# EAGLE design zigduino-micro-2 (EAGLE 6.3)
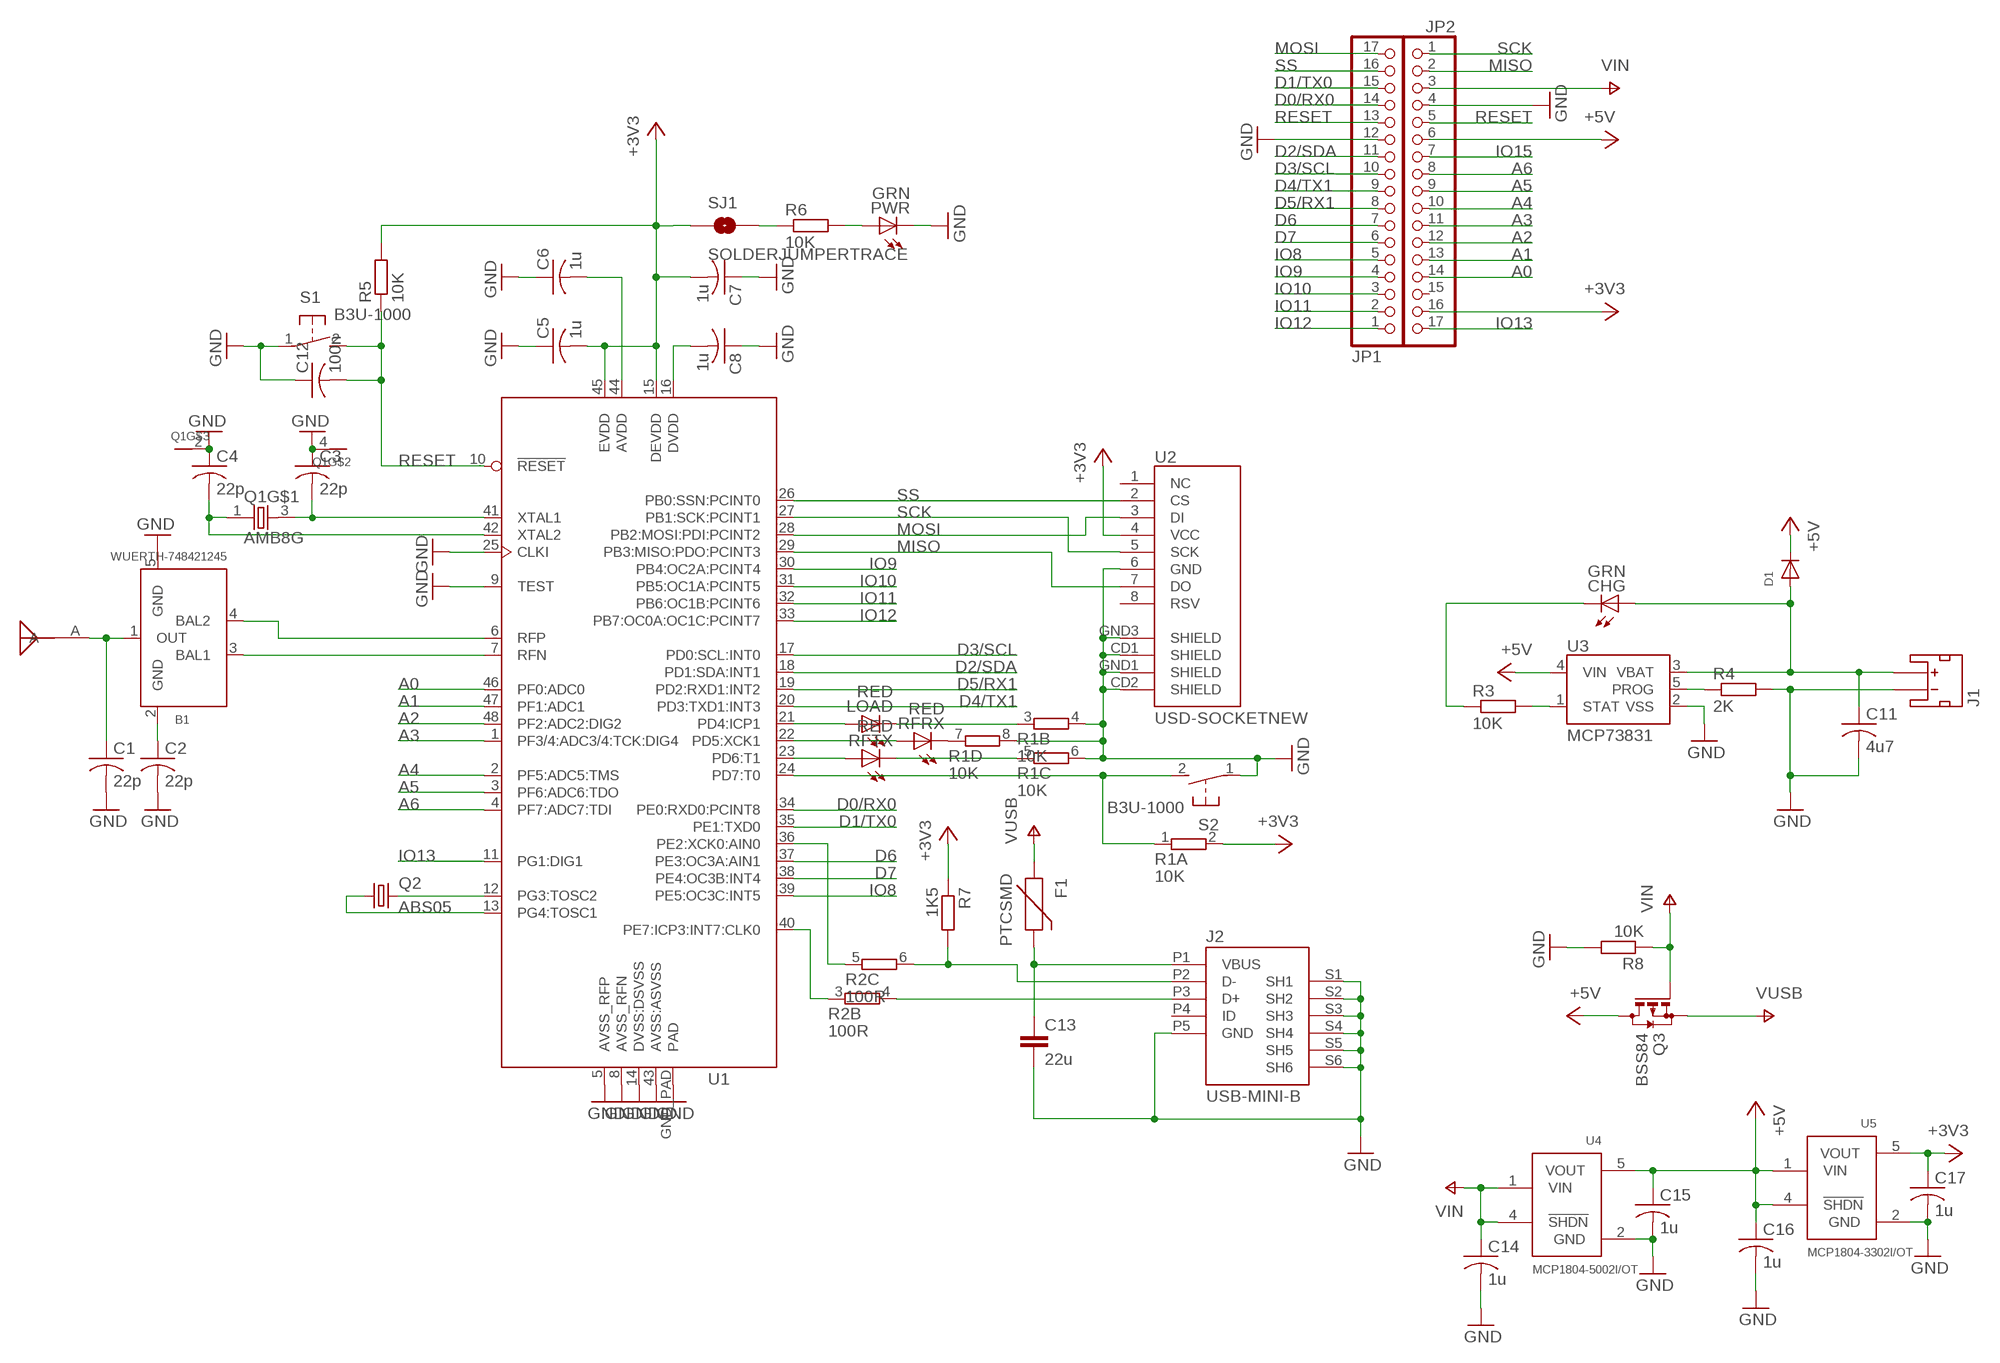
[diagram p0: schematic, sheet 1]

## Parts
ANT1  ATMEGA128RFA1_MOLEX-ANT  [ATMEGA128RFA1_MOLEX-ANT]
B1  WUERTH-748421245  [WURTH-BALUN]
C1  22p  C-USC0603  [C0603]
C2  22p  C-USC0603  [C0603]
C3  22p  C-USC0603  [C0603]
C4  22p  C-USC0603  [C0603]
C5  1u  C-USC0603  [C0603]
C6  1u  C-USC0603  [C0603]
C7  1u  C-USC0603  [C0603]
C8  1u  C-USC0603  [C0603]
C11  4u7  C-USC0603  [C0603]
C12  100n  C-USC0603  [C0603]
C13  22u  C-EUC0805  [C0805]
C14  1u  C-USC0603  [C0603]
C15  1u  C-USC0603  [C0603]
C16  1u  C-USC0603  [C0603]
C17  1u  C-USC0603  [C0603]
CHG  GRN  LEDCHIPLED_0603  [CHIPLED_0603]
D1  DIODESOD-123  [SOD-123]
F1  PTCSMD  [PTC-1206]
J1  JST_2MM_MALE  [JST-2-SMD]
J2  USB-MINI-B  [SMARTPRJ_CON2_USB_MICRO_B_AT]
JP1  PINHD-1X17_2.54-SMD  [1X17SMD]
JP2  PINHD-1X17_2.54-SMD  [1X17SMD]
LOAD  RED  LEDCHIPLED_0603  [CHIPLED_0603]
PWR  GRN  LEDCHIPLED_0603  [CHIPLED_0603]
Q1  AMB8G  [ABM8G]
Q2  ABS05  [ABS05]
Q3  BSS84  [SOT23]
R1  10K  4R-NCTS742C083  [CTS742C083-RES]
R2  100R  4R-NCTS742C083  [CTS742C083-RES]
R3  10K  R-EU_R0603  [R0603]
R4  2K  R-EU_R0603  [R0603]
R5  10K  R-EU_R0603  [R0603]
R6  10K  R-EU_R0603  [R0603]
R7  1K5  R-EU_R0603  [R0603]
R8  10K  R-EU_R0603  [R0603]
RFRX  RED  LEDCHIPLED_0603  [CHIPLED_0603]
RFTX  RED  LEDCHIPLED_0603  [CHIPLED_0603]
S1  B3U-1000  [B3U]
S2  B3U-1000  [B3U]
SJ1  SOLDERJUMPERTRACE  [SJ_2S-TRACE]
U1  ATMEGA1284RFR2  [QFN48]
U2  USD-SOCKETNEW  [MICRO-SD-SOCKET-PP]
U3  MCP73831  [SOT23-5]
U4  MCP1804-5002I/OT  [SOT23-5L]
U5  MCP1804-3302I/OT  [SOT23-5L]

## Nets
+3V3: C5.2 C7.2 C17.1 JP2.16 R1.2 R5.2 R7.1 SJ1.1 U1.15(DEVDD) U1.45(EVDD) U2.4(VCC) U5.5(VOUT)
+5V: C15.1 C16.1 D1.C JP2.6 Q3.3(D) U3.4(VIN) U4.5(VOUT) U5.1(VIN) U5.4(!SHDN!)
A0: JP2.14 U1.46(PF0:ADC0)
A1: JP2.13 U1.47(PF1:ADC1)
A2: JP2.12 U1.48(PF2:ADC2:DIG2)
A3: JP2.11 U1.1(PF3/4:ADC3/4:TCK:DIG4)
A4: JP2.10 U1.2(PF5:ADC5:TMS)
A5: JP2.9 U1.3(PF6:ADC6:TDO)
A6: JP2.8 U1.4(PF7:ADC7:TDI)
D0/RX0: JP1.14 U1.34(PE0:RXD0:PCINT8)
D1/TX0: JP1.15 U1.35(PE1:TXD0)
D2/SDA: JP1.11 U1.18(PD1:SDA:INT1)
D3/SCL: JP1.10 U1.17(PD0:SCL:INT0)
D4/TX1: JP1.9 U1.20(PD3:TXD1:INT3)
D5/RX1: JP1.8 U1.19(PD2:RXD1:INT2)
D6: JP1.7 U1.37(PE3:OC3A:AIN1)
D7: JP1.6 U1.38(PE4:OC3B:INT4)
GND: B1.5(GND) C1.2 C2.2 C3.1 C4.1 C5.1 C6.1 C7.1 C8.1 C11.2 C12.1 C13.2 C14.2 C15.2 C16.2 C17.2 J1.1(-) J2.P5(GND) J2.S1(SH1) J2.S2(SH2) J2.S3(SH3) J2.S4(SH4) J2.S5(SH5) J2.S6(SH6) JP1.12 JP2.4 PWR.C Q1.2(PIN) Q1.4(PIN) R1.4 R1.6 R1.8 R4.2 R8.2 S1.1 S2.1 U1.5(AVSS_RFP) U1.8(AVSS_RFN) U1.9(TEST) U1.14(DVSS:DSVSS) U1.25(CLKI) U1.43(AVSS:ASVSS) U1.GND_PAD(PAD) U2.6(GND) U2.CD1(SHIELD) U2.CD2(SHIELD) U2.GND1(SHIELD) U2.GND3(SHIELD) U3.2(VSS) U4.2(GND) U5.2(GND)
IO8: JP1.5 U1.39(PE5:OC3C:INT5)
IO9: JP1.4 U1.30(PB4:OC2A:PCINT4)
IO10: JP1.3 U1.31(PB5:OC1A:PCINT5)
IO11: JP1.2 U1.32(PB6:OC1B:PCINT6)
IO12: JP1.1 U1.33(PB7:OC0A:OC1C:PCINT7)
IO13: JP2.17 U1.11(PG1:DIG1)
IO15: JP2.7
MISO: JP2.2 U1.29(PB3:MISO:PDO:PCINT3) U2.7(DO)
MOSI: JP1.17 U1.28(PB2:MOSI:PDI:PCINT2) U2.3(DI)
N$1: ANT1.A B1.1(OUT) C1.1
N$2: B1.3(BAL1) U1.7(RFN)
N$3: B1.4(BAL2) U1.6(RFP)
N$4: B1.2(GND) C2.1
N$5: C3.2 Q1.3 U1.41(XTAL1)
N$6: Q2.2 U1.12(PG3:TOSC2)
N$7: C4.2 Q1.1 U1.42(XTAL2)
N$8: C6.2 U1.44(AVDD)
N$9: Q2.1 U1.13(PG4:TOSC1)
N$10: C8.2 U1.16(DVDD)
N$11: LOAD.A U1.21(PD4:ICP1)
N$12: R2.3 U1.40(PE7:ICP3:INT7:CLK0)
N$13: R2.5 U1.36(PE2:XCK0:AIN0)
N$14: RFTX.A U1.23(PD6:T1)
N$15: PWR.A R6.2
N$16: RFRX.A U1.22(PD5:XCK1)
N$17: R1.7 RFRX.C
N$18: R1.5 RFTX.C
N$19: J2.P2(D-) R2.6 R7.2
N$20: J2.P3(D+) R2.4
N$21: LOAD.C R1.3
N$22: R1.1 S2.2 U1.24(PD7:T0)
N$23: R6.1 SJ1.2
N$25: C11.1 CHG.A D1.A J1.2(+) U3.3(VBAT)
N$26: R3.2 U3.1(STAT)
N$27: R4.1 U3.5(PROG)
N$28: C13.1 F1.2 J2.P1(VBUS)
N$29: CHG.C R3.1
RESET: C12.2 JP1.13 JP2.5 R5.1 S1.2 U1.10(!RESET!)
SCK: JP2.1 U1.27(PB1:SCK:PCINT1) U2.5(SCK)
SS: JP1.16 U1.26(PB0:SSN:PCINT0) U2.2(CS)
VIN: C14.1 JP2.3 Q3.1(G) R8.1 U4.1(VIN) U4.4(!SHDN!)
VUSB: F1.1 Q3.2(S)
Unconnected: J1.NC1(PAD1) J1.NC2(PAD2) J2.P4(ID) JP2.15 R2.1 R2.2 R2.7 R2.8 U2.1(NC) U2.8(RSV)

## Library data of the parts
ANT1 = atmega128rfa1:ATMEGA128RFA1_MOLEX-ANT
B1 = atmega128rfa1:WUERTH-748421245: Recommended Balun for Atmega128RFA1
C1-C8 C11 C12 C14-C17 = resistor:C-US: CAPACITOR, American symbol
C13 = resistor:C-EU: CAPACITOR, European symbol
CHG LOAD PWR RFRX RFTX = led:LED: LED OSRAM: - CHIPLED LG R971, LG N971, LY N971, LG Q971, LY Q971, LO R971, LY R971 LH N974, LH R974 LS Q976, LO Q976, LY Q976 LO Q996 - Hyper CHIPLED LW Q18S LB Q993, LB Q99A, LB R99A - SideLED LS A670, LO A670, LY A670, LG A670, LP A670 LB A673, LV A673, LT A673, LW A673 LH A674 LY A675 LS A676, LA A676, LO A676, LY A676, LW A676 LS A679, LY A679, LG A679 - Hyper Micro SIDELED® LS Y876, LA Y876, LO Y876, LY Y876 LT Y87S - SmartLED LW L88C, LW L88S LB L89C, LB L89S, LG L890 LS L89K, LO L89K, LY L89K LS L896, LA L896, LO L896, LY L896 - TOPLED LS T670, LO T670, LY T670, LG T670, LP T670 LSG T670, LSP T670, LSY T670, LOP T670, LYG T670 LG T671, LOG T671, LSG T671 LB T673, LV T673, LT T673, LW T673 LH T674 LS T676, LA T676, LO T676, LY T676, LB T676, LH T676, LSB T676, LW T676 LB T67C, LV T67C, LT T67C, LS T67K, LO T67K, LY T67K, LW E67C LS E67B, LA E67B, LO E67B, LY E67B, LB E67C, LV E67C, LT E67C LW T67C LS T679, LY T679, LG T679 LS T770, LO T770, LY T770, LG T770, LP T770 LB T773, LV T773, LT T773, LW T773 LH T774 LS E675, LA E675, LY E675, LS T675 LS T776, LA T776, LO T776, LY T776, LB T776 LHGB T686 LT T68C, LB T68C - Hyper Mini TOPLED® LB M676 - Mini TOPLED Santana® LG M470 LS M47K, LO M47K, LY M47K Source: http://www.osram.convergy.de/
D1 = adafruit:DIODE: Diode SMADIODE - SMA Surface Mount Package 20V 1A Schottky Diode Digikey: 641-1014-6-ND DO-1N4148 - Through Hole Small Current Diode SOD-123 20V 1 A (.5mV Vf) Schottky Diode - Digikey: MBRX120TPMSCT-ND SOD-323 10V 570mA (.38mV Vf, 3ns) Schottky Diode - Digikey: ZLLS410CT-ND SOD-523 30V 30mA Schottky Diode (RB751S-40TE61) - Digikey: RB751S-40TE61CT-ND SOT23-R/W - SOT23 Package (R = Solder Paste/Reflow Ovens, W = Hand-Soldering) BAT54Film 40V 300mA - Digikey: 497-7162-1-ND
F1 = SparkFun-PowerIC:PTC: Resettable Fuse PTC Resettable Fuse. Spark Fun Electronics SKU : COM-08357
J1 = SparkFun-Connectors:JST_2MM_MALE: Mates to single-cell LiPo batteries. CONN-08352; PROD_ID: CONN-08352
J2 = logos-ftdi:USB-MINI-B
JP1 JP2 = pinhead-1:PINHD-1X17: PIN HEADER
Q1 = atmega128rfa1:AMB8G: AMB8G series ultraminature crystal
Q2 = logos-crystals:ABS05
Q3 = transistor-small-signal:BSS84: P-CHANNEL MOS FET
R1 R2 = res-cap-arrays:4R-N: Array Chip Resistor Source: RS Component / Phycomp
R3-R8 = resistor:R-EU_: RESISTOR, European symbol
S1 S2 = logos-faves:B3U-1000: Omron B3U-1000 SMD tact switch
SJ1 = SparkFun-Passives:SOLDERJUMPER: Solder Jumper Standard SMD solder jumper. Used to automate production. Two varients : Normally Open and Normally Closed are the same, but have different paste layers. NC will have a large amount of paste and should jumper during reflow.
U1 = atmega128rfa1:ATMEGA1284RFR2
U2 = SparkFun-Connectors:USD-SOCKET: microSD Socket Push-push type uSD socket. Schematic element and footprint production proven. Spark Fun Electronics SKU : PRT-00127. tDoc lines correctly indicate media card edge positions when inserting (unlocked, locked, depressed).
U3 = SparkFun-PowerIC:MCP73831: Miniature single cell, fully integrated Li-Ion, Li-polymer charge management controller http://ww1.microchip.com/downloads/en/DeviceDoc/21984a.pdf IC-09995; PROD_ID: IC-09995
U4 U5 = logos-power:MCP1804

## Board
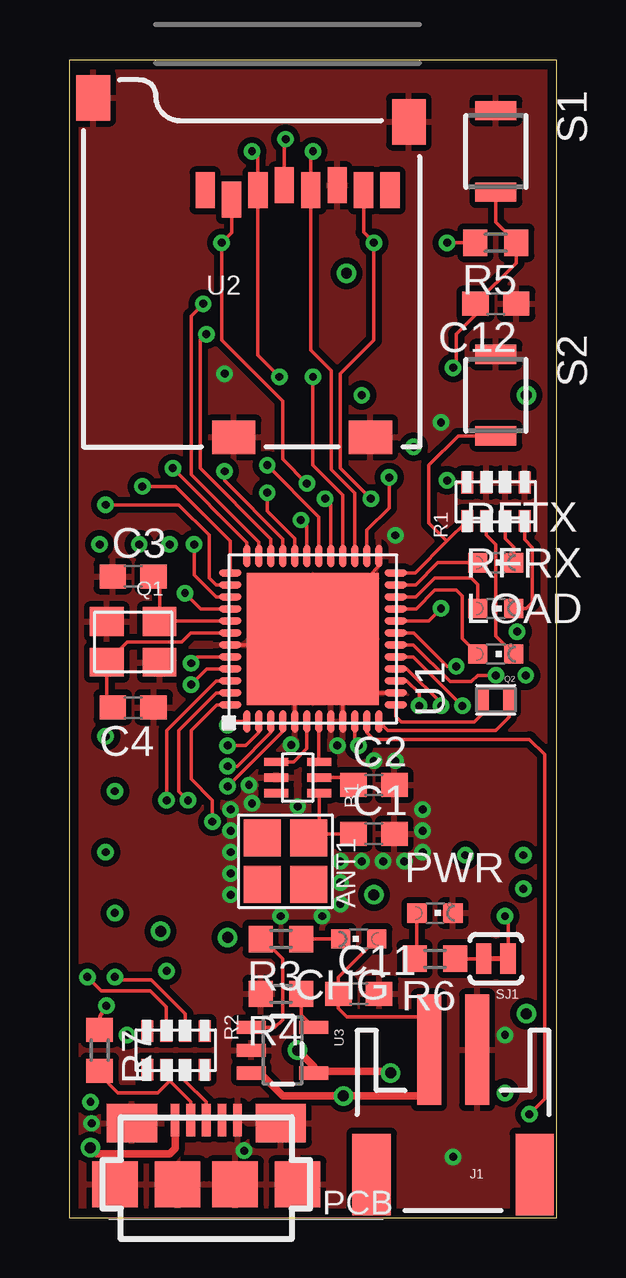
[diagram p1: board, top side]
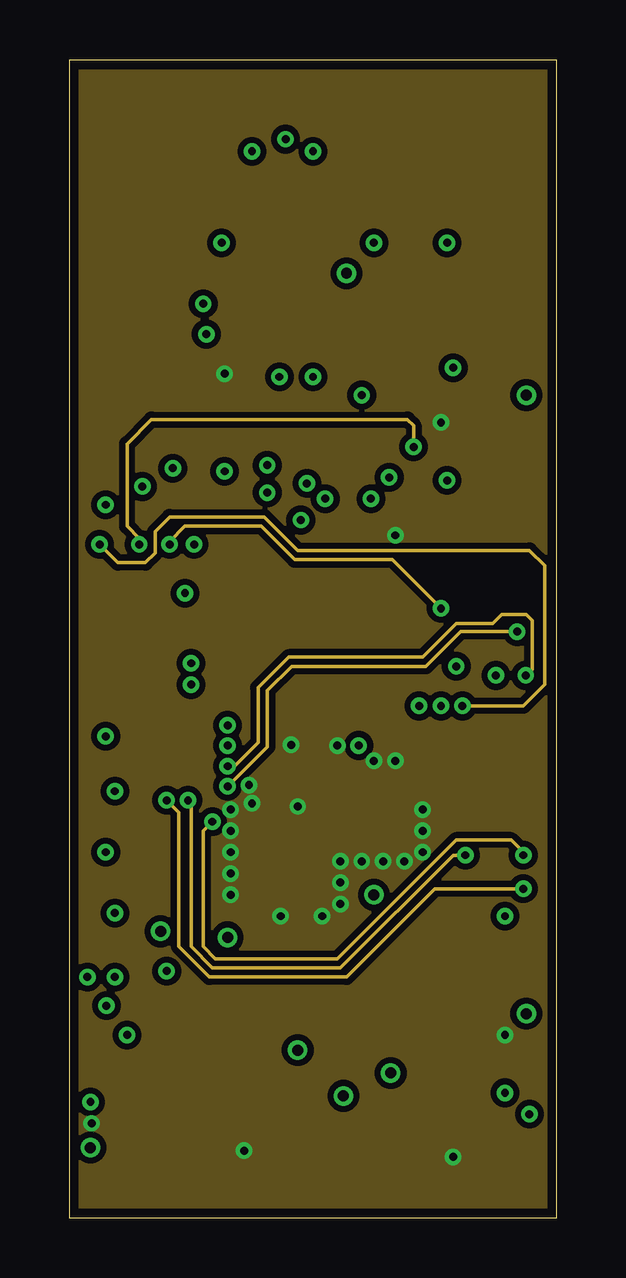
[diagram p2: board, inner layer Route2]
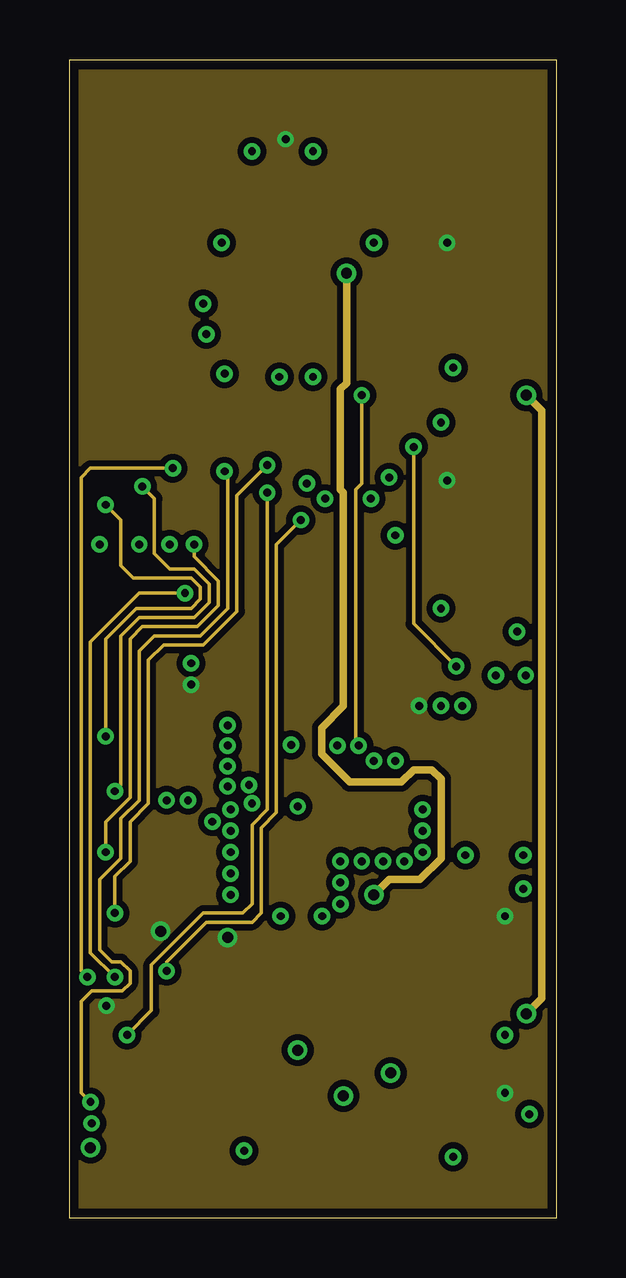
[diagram p3: board, inner layer Route15]
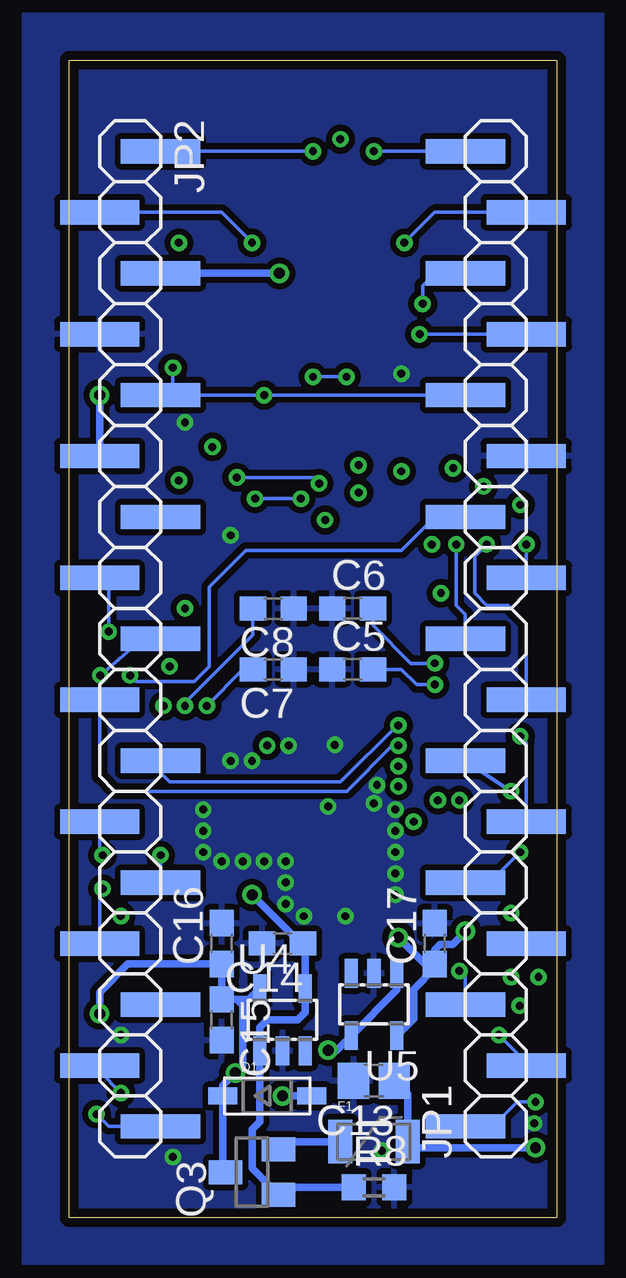
[diagram p4: board, bottom side, seen from below]

Size 20.32 x 48.26 mm. Coordinates in mm from the lower left corner, seen from the top.
Outline: 0,0 20.32,0 20.32,48.26 0,48.26 0,0
Copper layers (1*2+15*16): Top 0.0356mm / dielectric 1.5011mm / Route2 0.0356mm / dielectric 0.1499mm / Route15 0.0356mm / dielectric 0.2007mm / Bottom 0.0356mm
Design rules "LaenPCBOrder *": minimum track width 6mil, minimum drill 13mil, track to track 6mil, track to pad 6mil, pad to pad 6mil, via to via 6mil, smd to smd 6mil, copper to edge 15mil, drill to drill 6mil, minimum pad ring 7mil, minimum via ring 7mil, stop-mask expansion 4mil, vias tented up to drill 0mil, thermal gap 10mil

### Footprints (pad centres in the part's own frame; a part is rotated, then mirrored left to right if it is on the bottom)
ATMEGA128RFA1_MOLEX-ANT = smd 1.54 x 1.54: A -0.97,0.97; D@0 0.97,0.97; D@1 0.97,-0.97; D@2 -0.97,-0.97
WURTH-BALUN = smd 0.35 x 1: 1 0.65,0.9; 2 0,0.9; 3 -0.65,0.9; 4 -0.65,-0.9; 5 0,-0.9; 6 0.65,-0.9
C0603 = smd 1.1 x 1: 1 -0.85,0; 2 0.85,0
C0805 = smd 1.3 x 1.5: 1 -0.85,0; 2 0.85,0
CHIPLED_0603 = smd 0.8 x 0.8: A 0,-0.75; C 0,0.75
SOD-123 = smd 1.2 x 0.7: A 1.85,0; C -1.85,0
PTC-1206 = smd 1 x 1.8: 1 -1.4,0; 2 1.4,0
JST-2-SMD = smd 1 x 4.6: 1 -1,-3.7; 2 1,-3.7 | smd 1.6 x 3.4: NC1 -3.4,1.5; NC2 3.4,1.5
SMARTPRJ_CON2_USB_MICRO_B_AT = smd 0.4 x 1.35: P1 -1.3,2.675; P2 -0.65,2.675; P3 0,2.675; P4 0.65,2.675; P5 1.3,2.675 | smd 1.9 x 1.9: S1 -3.8,0; S2 3.8,0; S5 -1.2,0; S6 1.2,0 | smd 2.1 x 1.6: S3 -3.1,2.55; S4 3.1,2.55
1X17SMD = smd 1.016 x 3.302: 1 -1.27,1.27; 2 1.27,-1.27; 3 3.81,1.27; 4 6.35,-1.27; 5 8.89,1.27; 6 11.43,-1.27; 7 13.97,1.27; 8 16.51,-1.27; 9 19.05,1.27; 10 21.59,-1.27; 11 24.13,1.27; 12 26.67,-1.27; 13 29.21,1.27; 14 31.75,-1.27; 15 34.29,1.27; 16 36.83,-1.27; 17 39.37,1.27
ABM8G = smd 1.4 x 1.2: 1 -1.1,-0.85; 2 1.1,-0.85; 3 1.1,0.85; 4 -1.1,0.85
ABS05 = smd 0.5 x 1: 1 -0.55,0; 2 0.55,0
SOT23 = smd 1 x 1.4: 1 -0.95,-1.1; 2 0.95,-1.1; 3 0,1.1
CTS742C083-RES = smd 0.9 x 0.5: 1 -0.8,1.2; 2 0.8,1.2; 3 -0.8,0.4; 4 0.8,0.4; 5 -0.8,-0.4; 6 0.8,-0.4; 7 -0.8,-1.2; 8 0.8,-1.2
R0603 = smd 1 x 1.1: 1 -0.85,0; 2 0.85,0
B3U = smd 0.8 x 1.7: 1 -1.7,0; 2 1.7,0
SJ_2S-TRACE = smd 0.635 x 1.27: 1 -0.508,0; 2 0.508,0
QFN48 = smd 0.95 x 0.3: 1 -3.45,2.75; 2 -3.45,2.25; 3 -3.45,1.75; 4 -3.45,1.25; 5 -3.45,0.75; 6 -3.45,0.25; 7 -3.45,-0.25; 8 -3.45,-0.75; 9 -3.45,-1.25; 10 -3.45,-1.75; 11 -3.45,-2.25; 12 -3.45,-2.75; 25 3.45,-2.75; 26 3.45,-2.25; 27 3.45,-1.75; 28 3.45,-1.25; 29 3.45,-0.75; 30 3.45,-0.25; 31 3.45,0.25; 32 3.45,0.75; 33 3.45,1.25; 34 3.45,1.75; 35 3.45,2.25; 36 3.45,2.75 | smd 0.3 x 0.95: 13 -2.75,-3.45; 14 -2.25,-3.45; 15 -1.75,-3.45; 16 -1.25,-3.45; 17 -0.75,-3.45; 18 -0.25,-3.45; 19 0.25,-3.45; 20 0.75,-3.45; 21 1.25,-3.45; 22 1.75,-3.45; 23 2.25,-3.45; 24 2.75,-3.45; 37 2.75,3.45; 38 2.25,3.45; 39 1.75,3.45; 40 1.25,3.45; 41 0.75,3.45; 42 0.25,3.45; 43 -0.25,3.45; 44 -0.75,3.45; 45 -1.25,3.45; 46 -1.75,3.45; 47 -2.25,3.45; 48 -2.75,3.45 | smd 5.5 x 5.5: GND_PAD 0,0
MICRO-SD-SOCKET-PP = smd 0.8 x 1.5: 1 -8.94,10.7; 2 -7.84,10.3; 3 -6.74,10.7; 4 -5.64,10.9; 5 -4.54,10.7; 6 -3.44,10.9; 7 -2.34,10.7; 8 -1.24,10.7 | smd 1.8 x 1.4: CD1 -2.05,0.4; CD2 -7.75,0.4 | smd 1.4 x 1.9: GND1 -13.6,14.55; GND3 -0.45,13.55
SOT23-5 = smd 0.55 x 1.2: 1 -0.95,-1.3; 2 0,-1.3; 3 0.95,-1.3; 4 0.95,1.3; 5 -0.95,1.3
SOT23-5L = smd 0.55 x 1.2: 1 -0.95,-1.3; 2 0,-1.3; 3 0.95,-1.3; 4 0.95,1.3; 5 -0.95,1.3

### Placement (x,y rotation side)
ANT1  9.02,14.86 270 top
B1  9.53,18.35 270 top
C1  12.7,16 0 top
C2  12.7,18.03 0 top
C3  2.67,26.73 0 top
C4  2.67,21.27 180 top
C5  8.51,22.86 0 bottom
C6  8.51,25.4 0 bottom
C7  11.81,22.86 180 bottom
C8  11.81,25.4 180 bottom
C11  12.06,9.33 0 top
C12  17.78,38.1 180 top
C13  7.62,5.71 180 bottom
C14  11.43,11.43 180 bottom
C15  13.97,8.26 270 bottom
C16  13.97,11.43 90 bottom
C17  5.08,11.43 90 bottom
CHG  12.06,11.62 90 top
D1  12.06,5.08 0 bottom
F1  7.62,3.17 0 bottom
J1  16,3.3 180 top
J2  5.71,1.4 0 top
JP1  2.54,5.08 90 bottom
JP2  17.78,43.18 270 bottom
LOAD  17.78,23.5 270 top
PWR  15.24,12.7 270 top
Q1  2.67,24 0 top
Q2  17.78,21.59 0 top
Q3  12.7,1.91 90 bottom
R1  17.78,29.84 90 top
R2  4.45,6.99 270 top
R3  8.83,11.62 180 top
R4  8.83,9.33 180 top
R5  17.78,40.64 180 top
R6  15.24,10.79 180 top
R7  1.27,6.99 270 top
R8  7.62,1.27 0 bottom
RFRX  17.78,25.4 270 top
RFTX  17.78,27.3 270 top
S1  17.78,44.45 270 top
S2  17.78,34.29 270 top
SJ1  17.78,10.79 180 top
U1  10.16,24.13 90 top
U2  14.61,32.13 0 top
U3  8.89,6.99 270 top
U4  11.43,8.26 0 bottom
U5  7.62,8.89 180 bottom

### Tracks (layer width: path | path; a pad name or v marks a point on that pad's centre or on a via)
+3V3  (via drill 0.33, 0.46)
  Top 0.152: U2.4 8.96,44.91 v9.02,44.96 | R5.2 v15.75,40.64 | R1.2 15.84,30.64 v15.75,30.73 | U1.15 14.07,22.38 14.58,21.87 v14.58,21.34 | U1.45 5.74,22.88 v5.08,22.23 | R7.1 1.27,8.38 v1.55,8.84 | SJ1.1 18.29,12.45 v18.16,12.57
  Route15 0.305: v3.81,11.94 3.81,12.19
  Bottom 0.152: C7.2 13.08,22.86 v14.58,21.34 | JP2.16 19.05,6.1 v18.16,5.21 | C5.2 6.48,22.86 5.84,22.23 v5.08,22.23
  Bottom 0.305: 5.08,10.41 C17.1 5.08,11.18 4.85,11.4 4.34,11.4 v3.81,11.94 | 5.08,10.41 5.97,9.53 5.97,8.29 U5.5 | 5.08,10.41 5.33,10.41 v6.6,11.68
  pour Route15 (isolate 0.254): -1.27,49.53 21.59,49.53 21.59,-1.27 -1.27,-1.27
+5V  (via drill 0.46)
  Top 0.305: U3.4 10.19,6.19 | v9.53,6.99 10.19,6.32 10.19,6.19 | 10.19,6.19 10.29,6.1 13.34,6.1 v13.4,6.03
  Route15 0.305: v19.05,8.51 19.68,9.14 19.68,33.66 v19.05,34.29
  Bottom 0.305: 13.34,9.11 C15.1 C16.1 17.87,10.58 19.05,9.4 v19.05,8.51 | 13.34,9.11 12.83,9.11 U4.5 | Q3.3 13.91,2.02 D1.C 13.91,5.52 v13.4,6.03 13.08,6.35 13.08,8.85 13.34,9.11 | U5.1 6.67,9.49 U5.4 9.18,6.99 v9.53,6.99 | v19.05,34.29 JP2.6
A0  (via drill 0.33)
  Top 0.152: U1.46 6.12,22.38 4.06,20.32 v4.06,17.4
  Route2 0.152: v18.92,13.72 15.24,13.72 11.56,10.03 5.84,10.03 4.57,11.3 4.57,16.89 v4.06,17.4
  Bottom 0.152: JP2.14 19.05,13.59 v18.92,13.72
A1  (via drill 0.33)
  Top 0.152: U1.47 6.13,21.88 4.57,20.32 4.57,17.78 v4.95,17.4
  Route2 0.152: v16.51,15.11 16,15.11 11.3,10.41 5.97,10.41 5.08,11.3 5.08,17.27 v4.95,17.4
  Bottom 0.152: JP2.13 v16.51,15.11
A2  (via drill 0.33)
  Top 0.152: U1.48 6.14,21.38 5.08,20.32 5.08,18.29 5.97,17.4 v5.97,16.51
  Route2 0.152: v18.92,15.11 18.92,15.24 18.41,15.75 16.13,15.75 11.18,10.79 6.1,10.79 5.59,11.3 5.59,16.13 v5.97,16.51
  Bottom 0.152: JP2.12 19.05,15.24 v18.92,15.11
A3  (via drill 0.33)
  Top 0.152: U1.1 6.71,20.68 v6.6,20.52
  Bottom 0.152: JP2.11 16.51,18.54 16.13,18.16 9.02,18.16 6.66,20.52 v6.6,20.52
A4  (via drill 0.33)
  Top 0.152: U1.2 7.91,20.23 7.37,19.68 v6.6,19.68
  Bottom 0.152: 17.65,21.59 JP2.10 19.05,18.41 18.41,17.78 8.76,17.78 6.86,19.68 v6.6,19.68
A5  (via drill 0.33)
  Top 0.152: U1.3 8.41,20.22 7.01,18.82 v6.6,18.82
  Route2 0.152: v19.02,22.61 19.05,22.61 19.3,22.86 19.3,24.89 19.05,25.15 18.03,25.15 17.65,24.77 16.13,24.77 14.73,23.37 9.14,23.37 7.87,22.1 7.87,19.81 6.88,18.82 v6.6,18.82
  Bottom 0.152: JP2.9 17.27,24.13 v19.02,22.61
A6  (via drill 0.33)
  Top 0.152: U1.4 8.91,20.26 7.9,19.28 v6.6,17.98
  Route2 0.152: v18.67,24.43 16.31,24.43 14.86,22.99 9.27,22.99 8.26,21.97 8.26,19.63 v6.6,17.98
  Bottom 0.152: 18.92,26.67 JP2.8 18.67,26.29 v18.67,24.43
D0/RX0  (via drill 0.33)
  Top 0.152: U1.34 8.41,28.29 5.46,31.24 5.46,36.58 v5.71,36.83
  Bottom 0.152: v5.71,36.83 JP1.14
D1/TX0  (via drill 0.33)
  Top 0.152: U1.35 7.91,28.16 5.08,30.99 5.08,37.59 v5.59,38.1
  Bottom 0.152: v5.59,38.1 5.59,38.86 5.08,39.37 JP1.15
D2/SDA  (via drill 0.33)
  Top 0.152: U1.18 14.35,23.88 15.88,22.35 16.76,22.35 17.02,22.61 v17.78,22.61
  Bottom 0.152: JP1.11 5.08,29.21 6.48,27.81 12.95,27.81 14.48,26.29 14.48,22.99 15.11,22.35 17.53,22.35 v17.78,22.61
D3/SCL  (via drill 0.33)
  Top 0.152: U1.17 14.34,23.38 v16.38,21.34
  Route2 0.152: v16.38,21.34 18.92,21.34 19.81,22.23 19.81,27.18 19.18,27.81 9.53,27.81 8.13,29.21 4.19,29.21 3.58,28.6 3.58,27.71 3.17,27.3 2.03,27.3 v1.27,28.07
  Bottom 0.152: JP1.10 v1.27,28.07
D4/TX1  (via drill 0.33)
  Top 0.152: U1.20 14.97,24.88 v15.49,25.4
  Route2 0.152: v4.19,28.07 4.19,28.19 4.83,28.83 8,28.83 9.4,27.43 13.46,27.43 v15.49,25.4
  Bottom 0.152: JP1.9 3.81,25.15 4.19,25.53 v4.19,28.07
D5/RX1  (via drill 0.33)
  Top 0.152: U1.19 14.36,24.38 15.75,22.99 v16.13,22.99
  Route2 0.152: v2.92,28.07 2.92,28.32 2.41,28.83 2.41,32.26 3.43,33.27 14.1,33.27 14.35,33.02 v14.35,32.13
  Route15 0.152: v14.35,32.13 14.35,24.77 v16.13,22.99
  Bottom 0.152: JP1.8 1.27,24.77 2.03,25.53 2.92,25.53 3.43,26.04 3.43,27.56 v2.92,28.07
D6  (via drill 0.33)
  Top 0.152: U1.37 6.71,28.21 4.45,30.48 v3.05,30.48
  Route15 0.152: v3.05,30.48 3.56,29.97 3.56,27.69 4.19,27.05 5.21,27.05 5.84,26.42 5.84,25.65 5.21,25.02 2.92,25.02 2.16,24.26 2.16,18.03 v1.91,17.78
  Bottom 0.152: JP1.7 v1.91,17.78
D7  (via drill 0.33)
  Top 0.152: U1.38 6.13,26.38 5.84,26.67 5.84,28.45 4.57,29.72 v1.52,29.72
  Route15 0.152: v1.52,20.07 1.52,24.13 2.79,25.4 5.08,25.4 5.46,25.78 5.46,26.29 5.08,26.67 2.67,26.67 2.16,27.18 2.16,29.08 v1.52,29.72
  Bottom 0.152: JP1.6 1.27,19.81 v1.52,20.07
GND  (via drill 0.33)
  Top 0.152: U1.14 12.41,21.88 U1.GND_PAD | U1.GND_PAD 10.16,22.73 11.41,21.48 U1.9 | U1.43 9.91,23.88 | U1.5 9.41,23.38 9.91,23.88 | U1.25 12.91,27.16 12.5,26.75 12.5,26.47 U1.GND_PAD | 9.91,23.88 U1.GND_PAD
  other vias: 6.48,35.18 11.18,19.68 12.7,19.05 13.59,19.05 14.73,17.02 14.73,16.13 14.73,15.24 13.97,14.86 13.08,14.86 12.19,14.86 11.3,14.86 11.3,13.97 11.3,13.08 10.54,12.57 8.81,12.57 6.73,13.46 6.73,14.35 6.73,15.24 6.73,16.13 6.73,17.02 7.62,17.27 9.53,17.14 7.49,18.03 0.94,3.94 16,2.54 18.16,7.62 15.49,33.15 7.29,2.79 9.25,19.71 13.59,28.45
  pour Top (isolate 0.254): 0,48.26 20.32,48.26 20.32,0 0,0
  pour Route2 (isolate 0.254): -0.64,48.9 20.95,48.9 20.95,-0.64 -0.64,-0.64
  pour Bottom (isolate 0.254): -1.91,50.16 22.23,50.16 22.23,-1.91 -1.91,-1.91
IO8  (via drill 0.33)
  Top 0.152: U1.39 6.12,25.88 5.21,26.8 v5.21,28.07
  Route15 0.152: v5.21,28.07 5.21,27.56 6.22,26.54 6.22,25.53 5.33,24.64 3.05,24.64 2.54,24.13 2.54,17.53 1.52,16.51 v1.52,15.24
  Bottom 0.152: JP1.5 2.79,13.97 v1.52,15.24
IO9  (via drill 0.33)
  Top 0.152: U1.30 10.41,29.21 v8.26,31.37
  Route15 0.152: v1.91,12.7 1.91,14.22 2.54,14.86 2.54,16.51 3.3,17.27 3.3,23.24 3.94,23.88 5.59,23.88 6.99,25.27 6.99,30.1 v8.26,31.37
  Bottom 0.152: JP1.4 1.27,12.06 v1.91,12.7
IO10  (via drill 0.33)
  Top 0.152: U1.31 9.91,28.82 v9.65,29.08
  Route15 0.152: v9.65,29.08 8.64,28.07 8.64,16.89 8,16.26 8,12.7 7.62,12.32 5.71,12.32 4.06,10.67 v4.06,10.29
  Bottom 0.152: JP1.3 3.81,10.03 v4.06,10.29
IO11  (via drill 0.33)
  Top 0.152: U1.32 9.41,28.31 8.26,29.46 v8.26,30.23
  Route15 0.152: v8.26,30.23 8.26,17.02 7.62,16.38 7.62,13.08 7.24,12.7 5.59,12.7 3.43,10.54 3.43,8.64 v2.41,7.62
  Bottom 0.152: JP1.2 1.27,6.48 v2.41,7.62
IO12  (via drill 0.33)
  Top 0.152: U1.33 8.91,28.3 6.48,30.73 v6.48,31.11
  Route15 0.152: v6.48,31.11 6.6,30.99 6.6,25.4 5.46,24.26 3.56,24.26 2.92,23.62 2.92,17.4 2.16,16.64 2.16,14.99 1.27,14.1 1.27,11.18 1.78,10.67 2.16,10.67 2.54,10.29 2.54,9.78 2.21,9.45 0.94,9.45 0.51,9.02 0.51,5.21 v0.89,4.83
  Bottom 0.152: JP1.1 2.67,3.81 1.65,4.83 v0.89,4.83
IO13  (via drill 0.33)
  Top 0.152: U1.11 12.41,20.23 12.7,19.94 19.18,19.94 19.81,19.3 19.81,4.95 v19.18,4.32
  Bottom 0.152: v19.18,4.32 18.67,3.81 JP2.17
MISO  (via drill 0.33)
  Top 0.152: U2.7 12.27,41.08 v12.7,40.64 12.7,36.58 11.3,35.18 11.3,31.24 v12.57,29.97 | U1.29 10.91,29.73 v10.67,29.97
  Bottom 0.152: JP2.2 13.97,41.91 v12.7,40.64 | v10.67,29.97 v12.57,29.97
MOSI  (via drill 0.33)
  Top 0.152: v7.62,44.45 7.87,44.2 U2.3 7.87,35.95 v8.76,35.05 | U1.28 11.41,30.12 10.16,31.37 v10.16,35.05
  Bottom 0.152: JP1.17 v7.62,44.45 | v8.76,35.05 v10.16,35.05
N$1
  Top 0.152: B1.1 10.43,16.27 ANT1.A 10.16,16 C1.1
N$2
  Top 0.152: U1.7 10.41,19.02 B1.3
N$3
  Top 0.152: U1.6 9.91,19.56 9.35,19 B1.4
N$4
  Top 0.152: B1.2 11.53,18.35 C2.1
N$5
  Top 0.152: U1.41 3.77,24.88 Q1.3 3.77,26.73 C3.2
N$6
  Top 0.152: Q2.2 18.33,20.87 17.78,20.32 13.27,20.32 U1.12
N$7
  Top 0.152: U1.42 5.06,24.38 4.69,24 2.42,24 Q1.1 1.57,21.52 C4.2
N$8  (via drill 0.33)
  Top 0.152: U1.44 5.35,23.38 v5.08,23.11
  Bottom 0.152: v5.08,23.11 6.1,23.11 7.66,24.68 C6.2
N$9
  Top 0.152: Q2.1 17.23,21.02 16.88,20.66 13.84,20.66 13.61,20.9 U1.13
N$10  (via drill 0.33)
  Top 0.152: U1.16 14.08,22.88 15.49,21.46 v15.49,21.34
  Bottom 0.152: C8.2 12.66,24.3 15.49,21.46 v15.49,21.34
N$11
  Top 0.152: U1.21 14.46,25.38 15.24,26.16 16.13,26.16 16.38,25.91 16.38,24.14 LOAD.A
N$12  (via drill 0.33)
  Top 0.152: U1.40 5.48,25.38 v4.83,26.04 | R2.3 4.84,8.49 3.43,9.91 2.03,9.91 v1.91,10.03
  Route15 0.152: v1.91,10.03 0.89,11.05 0.89,24 2.92,26.04 v4.83,26.04
N$13  (via drill 0.33)
  Top 0.152: U1.36 7.41,28.15 v4.32,31.24 | R2.5 4.04,8.78 3.38,9.45 1.35,9.45 v0.76,10.03
  Route15 0.152: v0.76,10.03 0.51,10.29 0.51,30.86 0.89,31.24 v4.32,31.24
N$14
  Top 0.152: U1.23 14.44,26.38 15.37,27.3 RFTX.A
N$15
  Top 0.152: PWR.A 14.49,10.89 R6.2
N$16
  Top 0.152: U1.22 14.45,25.88 15.24,26.67 16.76,26.67 17.03,26.4 RFRX.A
N$17
  Top 0.152: R1.7 18.98,28.26 19.3,27.94 19.3,25.65 19.05,25.4 RFRX.C
N$18
  Top 0.152: R1.5 18.18,28.3 18.53,27.95 RFTX.C
N$19
  Top 0.152: R2.6 4.04,5.86 4.19,5.71 | 4.19,5.71 5.07,4.84 J2.P2 | R7.2 1.27,5.97 2.03,5.21 3.68,5.21 4.19,5.71
N$20
  Top 0.152: J2.P3 5.71,4.83 4.84,5.7 R2.4
N$21
  Top 0.152: R1.3 17.38,28.47 17.78,28.07 17.78,24.25 LOAD.C
N$22
  Top 0.152: U1.24 14.41,26.88 15.74,28.2 | 15.74,28.2 R1.1 | S2.2 16.21,32.59 14.99,31.37 14.99,28.96 15.74,28.2
N$23
  Top 0.152: R6.1 SJ1.2
N$25  (via drill 0.46)
  Top 0.152: CHG.A 11.21,10.02 C11.1 11.21,8.72 11.56,8.38 14.48,8.38 14.99,7.87 14.99,7.02 J1.2
  Top 0.305: U3.3 7.93,6.04 8.89,5.08 v11.43,5.08 14.61,5.08 15,5.48 J1.2
  Bottom 0.305: v11.43,5.08 D1.A
N$26
  Top 0.152: R3.2 8.06,11.62 8.89,10.79 8.89,8.26 8.57,7.93 U3.1
N$27
  Top 0.152: R4.1 9.68,8.45 U3.5
N$28  (via drill 0.46)
  Top 0.305: J2.P1 4.42,2.89 4.19,2.67 1.14,2.67 v0.89,2.92
  Bottom 0.305: C13.1 6.22,5.17 F1.2 5.97,2.92 v0.89,2.92
N$29
  Top 0.152: CHG.C R3.1
RESET  (via drill 0.33)
  Top 0.152: S1.2 17.78,41.49 R5.1 18.63,39.8 C12.2 16.93,37.63 16.13,36.83 16.13,35.56 v16,35.43 | U1.10 11.91,19.84 v12.06,19.68
  Route15 0.152: v12.19,34.29 12.19,30.61 11.94,30.35 11.94,19.81 v12.06,19.68
  Bottom 0.152: JP1.13 v12.19,34.29 JP2.5 16,34.8 v16,35.43
SCK  (via drill 0.33)
  Top 0.152: v10.16,44.45 10.06,44.35 U2.5 10.06,36.16 10.92,35.31 10.92,31.19 11.91,30.2 U1.27
  Bottom 0.152: v10.16,44.45 JP2.1
SS  (via drill 0.33)
  Top 0.152: U2.2 6.76,41.05 v6.35,40.64 6.35,36.58 8.89,34.04 8.89,31.62 v9.91,30.61 | U1.26 12.41,28.67 13.34,29.59 v13.34,30.86
  Bottom 0.152: JP1.16 5.08,41.91 v6.35,40.64 | v13.34,30.86 10.16,30.86 v9.91,30.61
VIN  (via drill 0.46)
  Route15 0.305: v11.56,39.37 11.56,34.8 11.3,34.54 11.3,30.35 11.43,30.23 11.43,21.34 10.52,20.42 10.52,19.33 11.68,18.16 13.84,18.16 14.35,18.67 15.11,18.67 15.49,18.29 15.49,14.99 14.61,14.1 13.34,14.1 v12.7,13.46
  Bottom 0.305: JP2.3 v11.56,39.37 | U4.1 12.38,7.3 | U4.1 12.38,7.94 12.06,8.26 10.79,8.26 10.48,8.57 U4.4 10.48,11.33 C14.1 10.67,11.43 v12.7,13.46 | U4.1 12.38,4 12.7,3.68 12.7,2.06 Q3.1 11.29,1.27 R8.1
VUSB
  Bottom 0.305: F1.1 11.28,3.17 Q3.2